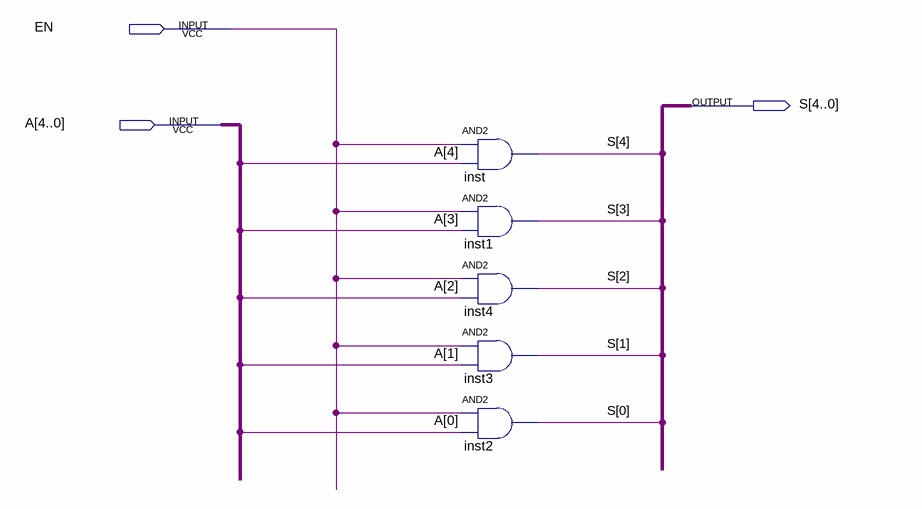
[diagram p0: schematic sheet]
// Quartus schematic Enabler.bdf as structural Verilog: 5 symbols, 3 pins
module Enabler (
  input  EN,
  input  [4:0] A,
  output [4:0] S
);

  and inst (S[4], EN, A[4]);
  and inst1 (S[3], EN, A[3]);
  and inst4 (S[2], EN, A[2]);
  and inst3 (S[1], EN, A[1]);
  and inst2 (S[0], EN, A[0]);
endmodule
